# EAGLE design luca (EAGLE 7.3.0)
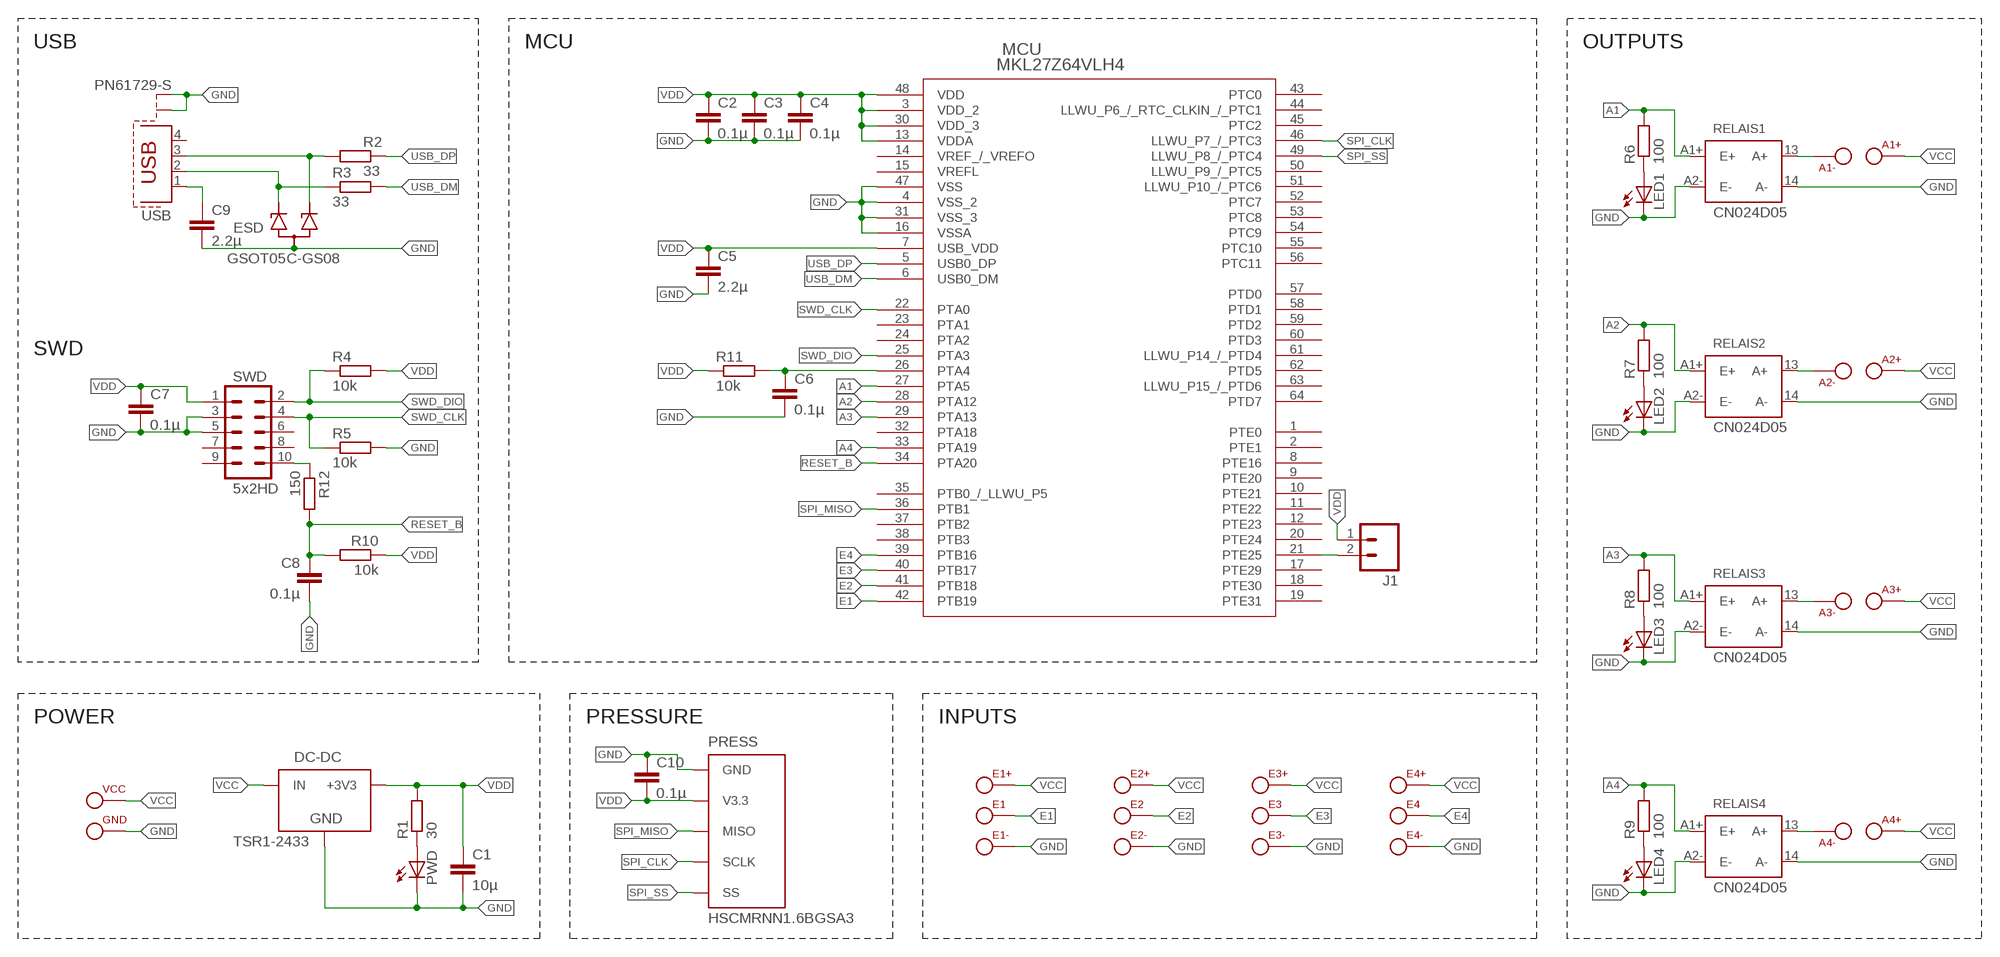
[diagram p0: schematic, sheet 1]

## Parts
A1+  FFKDS-2,54  [FFSDK-2,54]
A1-  FFKDS-2,54  [FFSDK-2,54]
A2+  FFKDS-2,54  [FFSDK-2,54]
A2-  FFKDS-2,54  [FFSDK-2,54]
A3+  FFKDS-2,54  [FFSDK-2,54]
A3-  FFKDS-2,54  [FFSDK-2,54]
A4+  FFKDS-2,54  [FFSDK-2,54]
A4-  FFKDS-2,54  [FFSDK-2,54]
C1  10µ  C-EUC1206  [C1206]
C2  0.1µ  C-EUC1206  [C1206]
C3  0.1µ  C-EUC1206  [C1206]
C4  0.1µ  C-EUC1206  [C1206]
C5  2.2µ  C-EUC1206  [C1206]
C6  0.1µ  C-EUC1206  [C1206]
C7  0.1µ  C-EUC1206  [C1206]
C8  0.1µ  C-EUC1206  [C1206]
C9  2.2µ  C-EUC1206  [C1206]
C10  0.1µ  C-EUC1206  [C1206]
DC-DC  TSR1-2433  [TSR-1]
E1  FFKDS-2,54  [FFSDK-2,54]
E1+  FFKDS-2,54  [FFSDK-2,54]
E1-  FFKDS-2,54  [FFSDK-2,54]
E2  FFKDS-2,54  [FFSDK-2,54]
E2+  FFKDS-2,54  [FFSDK-2,54]
E2-  FFKDS-2,54  [FFSDK-2,54]
E3  FFKDS-2,54  [FFSDK-2,54]
E3+  FFKDS-2,54  [FFSDK-2,54]
E3-  FFKDS-2,54  [FFSDK-2,54]
E4  FFKDS-2,54  [FFSDK-2,54]
E4+  FFKDS-2,54  [FFSDK-2,54]
E4-  FFKDS-2,54  [FFSDK-2,54]
ESD  GSOT05C-GS08  [GSOT05C-GS08]
GND  FFKDS-2,54  [FFSDK-2,54]
J1  M02LOCK  [1X02_LOCK]
LED1  LED  [LED]
LED2  LED  [LED]
LED3  LED  [LED]
LED4  LED  [LED]
MCU  MKL27Z64VLH4  [98ASS23234W]
PRESS  HSCMRNN1.6BGSA3  [HSCMRNN1.6BGSA3]
PWD  LED  [LED]
R1  30  R-EU_M1206  [M1206]
R2  33  R-EU_M1206  [M1206]
R3  33  R-EU_M1206  [M1206]
R4  10k  R-EU_M1206  [M1206]
R5  10k  R-EU_M1206  [M1206]
R6  100  R-EU_M1206  [M1206]
R7  100  R-EU_M1206  [M1206]
R8  100  R-EU_M1206  [M1206]
R9  100  R-EU_M1206  [M1206]
R10  10k  R-EU_M1206  [M1206]
R11  10k  R-EU_M1206  [M1206]
R12  150  R-EU_M1206  [M1206]
RELAIS1  CN024D05  [CN024D05]
RELAIS2  CN024D05  [CN024D05]
RELAIS3  CN024D05  [CN024D05]
RELAIS4  CN024D05  [CN024D05]
SWD  5x2HD  M05X22X  [2X5-PTH-1.27MM]
USB  PN61729-S  [PN61729-S]
VCC  FFKDS-2,54  [FFSDK-2,54]

## Nets
A1: MCU.27(PTA5) R6.2 RELAIS1.A1+(E+)
A2: MCU.28(PTA12) R7.2 RELAIS2.A1+(E+)
A3: MCU.29(PTA13) R8.2 RELAIS3.A1+(E+)
A4: MCU.33(PTA19) R9.2 RELAIS4.A1+(E+)
E1: E1.1 E1.2(P1) MCU.42(PTB19)
E2: E2.1 E2.2(P1) MCU.41(PTB18)
E3: E3.1 E3.2(P1) MCU.40(PTB17)
E4: E4.1 E4.2(P1) MCU.39(PTB16)
GND: C1.2 C2.2 C3.2 C4.2 C5.2 C6.2 C7.2 C8.2 C9.2 C10.1 DC-DC.2(GND) E1-.1 E1-.2(P1) E2-.1 E2-.2(P1) E3-.1 E3-.2(P1) E4-.1 E4-.2(P1) ESD.P$3 GND.1 GND.2(P1) LED1.B(C) LED2.B(C) LED3.B(C) LED4.B(C) MCU.4(VSS_2) MCU.16(VSSA) MCU.31(VSS_3) MCU.47(VSS) PRESS.P$1(GND) PWD.B(C) R5.2 RELAIS1.14(A-) RELAIS1.A2-(E-) RELAIS2.14(A-) RELAIS2.A2-(E-) RELAIS3.14(A-) RELAIS3.A2-(E-) RELAIS4.14(A-) RELAIS4.A2-(E-) SWD.3 SWD.5 USB.S1 USB.S2
N$1: ESD.P$1 R2.1 USB.3
N$2: ESD.P$2 R3.1 USB.2
N$3: C9.1 USB.1
N$4: LED2.A R7.1
N$5: LED1.A R6.1
N$6: A1-.1 A1-.2(P1) RELAIS1.13(A+)
N$7: LED3.A R8.1
N$8: PWD.A R1.1
N$9: A3-.1 A3-.2(P1) RELAIS3.13(A+)
N$10: LED4.A R9.1
N$11: A4-.1 A4-.2(P1) RELAIS4.13(A+)
N$13: J1.2 MCU.21(PTE25)
N$14: A2-.1 A2-.2(P1) RELAIS2.13(A+)
N$15: R12.1 SWD.10
NMI_B: C6.1 MCU.26(PTA4) R11.2
RESET_B: C8.1 MCU.34(PTA20) R10.2 R12.2
SPI_CLK: MCU.46(LLWU_P7_/_PTC3) PRESS.P$4(SCLK)
SPI_MISO: MCU.36(PTB1) PRESS.P$3(MISO)
SPI_SS: MCU.49(LLWU_P8_/_PTC4) PRESS.P$5(SS)
SWD_CLK: MCU.22(PTA0) R5.1 SWD.4
SWD_DIO: MCU.25(PTA3) R4.1 SWD.2
USB_DM: MCU.6(USB0_DM) R3.2
USB_DP: MCU.5(USB0_DP) R2.2
VCC: A1+.1 A1+.2(P1) A2+.1 A2+.2(P1) A3+.1 A3+.2(P1) A4+.1 A4+.2(P1) DC-DC.1(IN) E1+.1 E1+.2(P1) E2+.1 E2+.2(P1) E3+.1 E3+.2(P1) E4+.1 E4+.2(P1) VCC.1 VCC.2(P1)
VDD: C1.1 C2.1 C3.1 C4.1 C5.1 C7.1 C10.2 DC-DC.3(+3V3) J1.1 MCU.3(VDD_2) MCU.7(USB_VDD) MCU.13(VDDA) MCU.30(VDD_3) MCU.48(VDD) PRESS.P$2(V3.3) R1.2 R4.2 R10.1 R11.1 SWD.1
Unconnected: MCU.1(PTE0) MCU.2(PTE1) MCU.8(PTE16) MCU.9(PTE20) MCU.10(PTE21) MCU.11(PTE22) MCU.12(PTE23) MCU.17(PTE29) MCU.18(PTE30) MCU.19(PTE31) MCU.20(PTE24) MCU.23(PTA1) MCU.24(PTA2) MCU.32(PTA18) MCU.35(PTB0_/_LLWU_P5) MCU.37(PTB2) MCU.38(PTB3) MCU.43(PTC0) MCU.44(LLWU_P6_/_RTC_CLKIN_/_PTC1) MCU.45(PTC2) MCU.50(LLWU_P9_/_PTC5) MCU.51(LLWU_P10_/_PTC6) MCU.52(PTC7) MCU.53(PTC8) MCU.54(PTC9) MCU.55(PTC10) MCU.56(PTC11) MCU.57(PTD0) MCU.58(PTD1) MCU.59(PTD2) MCU.60(PTD3) MCU.61(LLWU_P14_/_PTD4) MCU.62(PTD5) MCU.63(LLWU_P15_/_PTD6) MCU.64(PTD7) SWD.6 SWD.7 SWD.8 SWD.9 USB.4

## Notes on the sheet
- USB | MCU | OUTPUTS
- SWD
- POWER | PRESSURE | INPUTS

## Power pins joined to a net without a drawn wire
VREF_/_VREFO: MCU.14(VREF_/_VREFO)
VREFL: MCU.15(VREFL)

## Library data of the parts
A1+ A1- A2+ A2- A3+ A3- A4+ A4- E1 E1+ E1- E2 E2+ E2- E3 E3+ E3- E4 E4+ E4- GND VCC = phoenix_contact:FFKDS-2,54
C1-C10 = rcl:C-EU: CAPACITOR, European symbol
DC-DC = SteelCaveRobotics-Power:TSR1-2433: Traco Power TSR 1-2433 3.3v switching regulator
ESD = GSOT05C-GS08:GSOT05C-GS08
J1 = SparkFun-Connectors:M02: Standard 2-pin 0.1" header. Use with - straight break away headers ( PRT-00116) - right angle break away headers (PRT-00553) - swiss pins (PRT-00743) - machine pins (PRT-00117) - female headers (PRT-00115) Molex polarized connector foot print use with: PRT-08233 with associated crimp pins and housings. 2.54_SCREWTERM for use with PRT-10571. 3.5mm Screw Terminal footprints for PRT-08084 5mm Screw Terminal footprints for use with PRT-08432
LED1-LED4 PWD = LED_luca:LED
MCU = MKL27Z64VLH4:MKL27Z64VLH4; MANUFACTURER_PART_NUMBER: mkl27z64vlh4; VENDOR: Freescale
PRESS = HSCMRNN1.6BGSA3:HSCMRNN1.6BGSA3
R1-R12 = rcl:R-EU_: RESISTOR, European symbol
RELAIS1-RELAIS4 = cn024d05:CN024D05
SWD = SparkFun-Connectors:M05X2: Header 5x2 Standard 10-pin dual row 0.1" header. Commonly used with AVR-ISP. Use with Spark Fun Electronics SKU: PRT-00778
USB = con-berg:PN61729-S: BERG USB connector; OC_FARNELL: unknown; OC_NEWARK: unknown

## Board
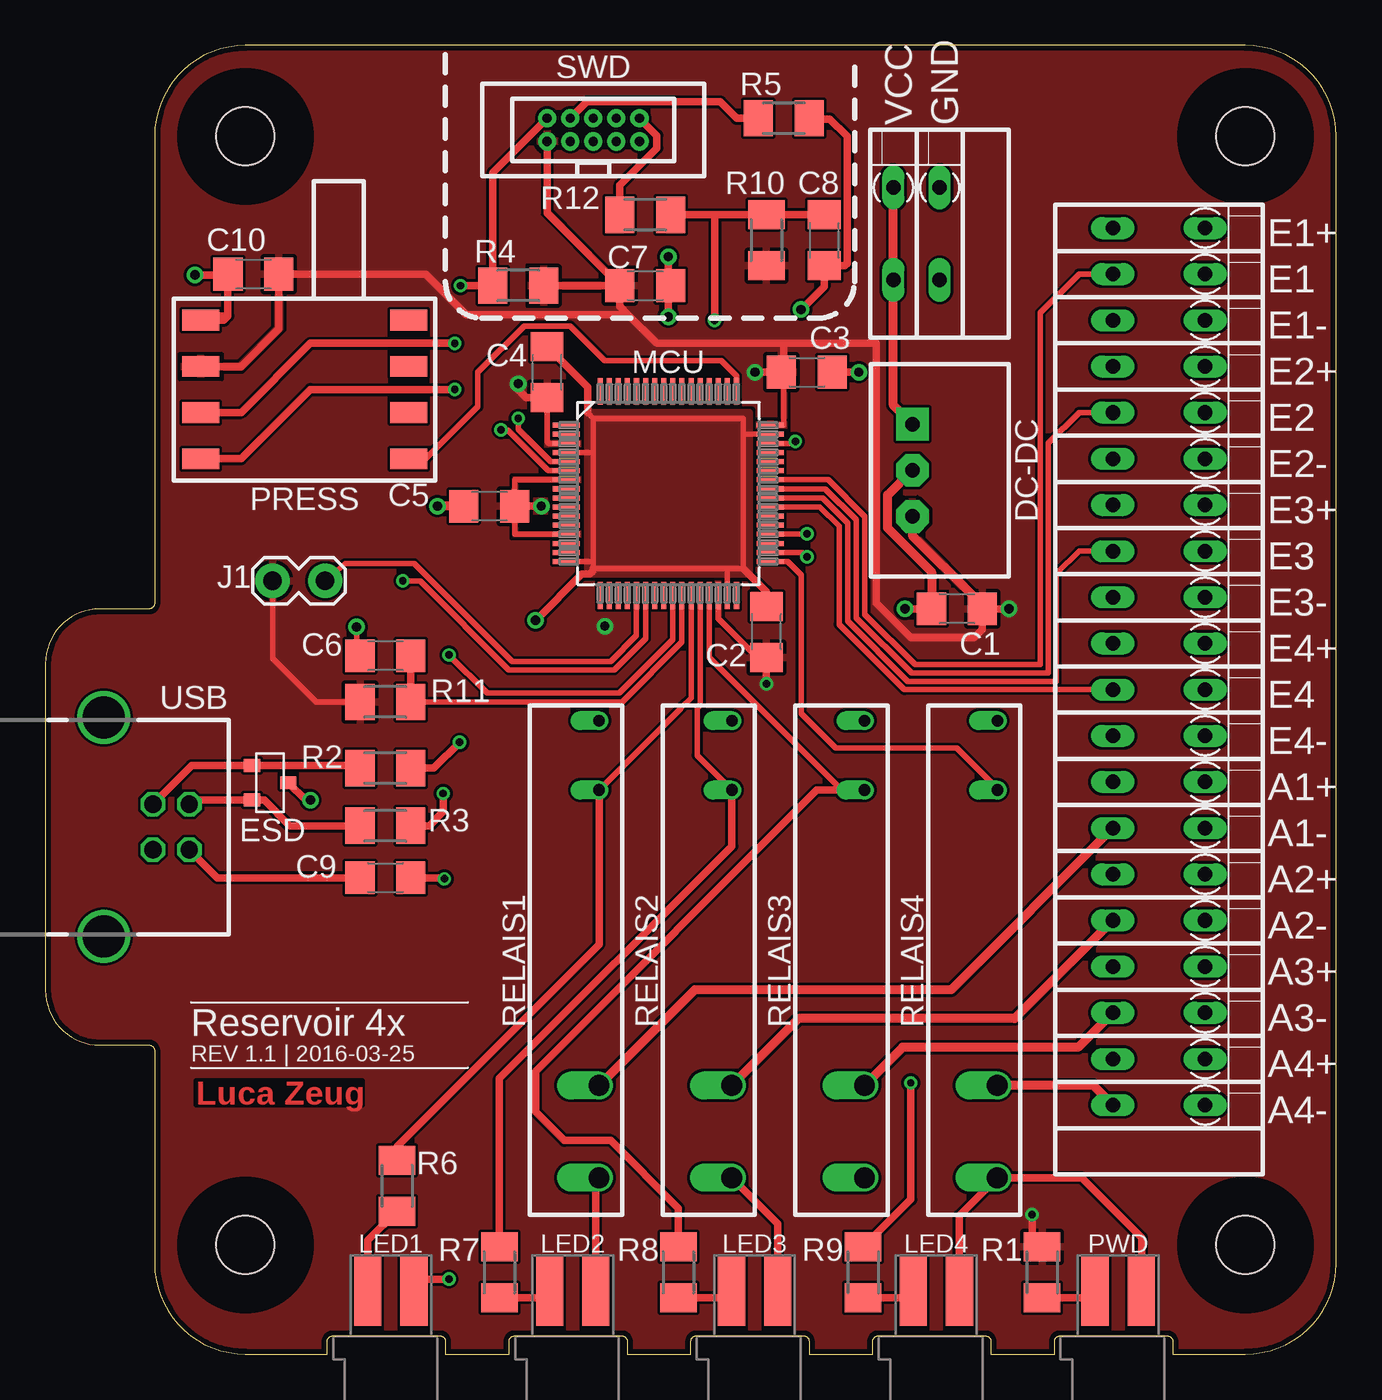
[diagram p1: board, top side]
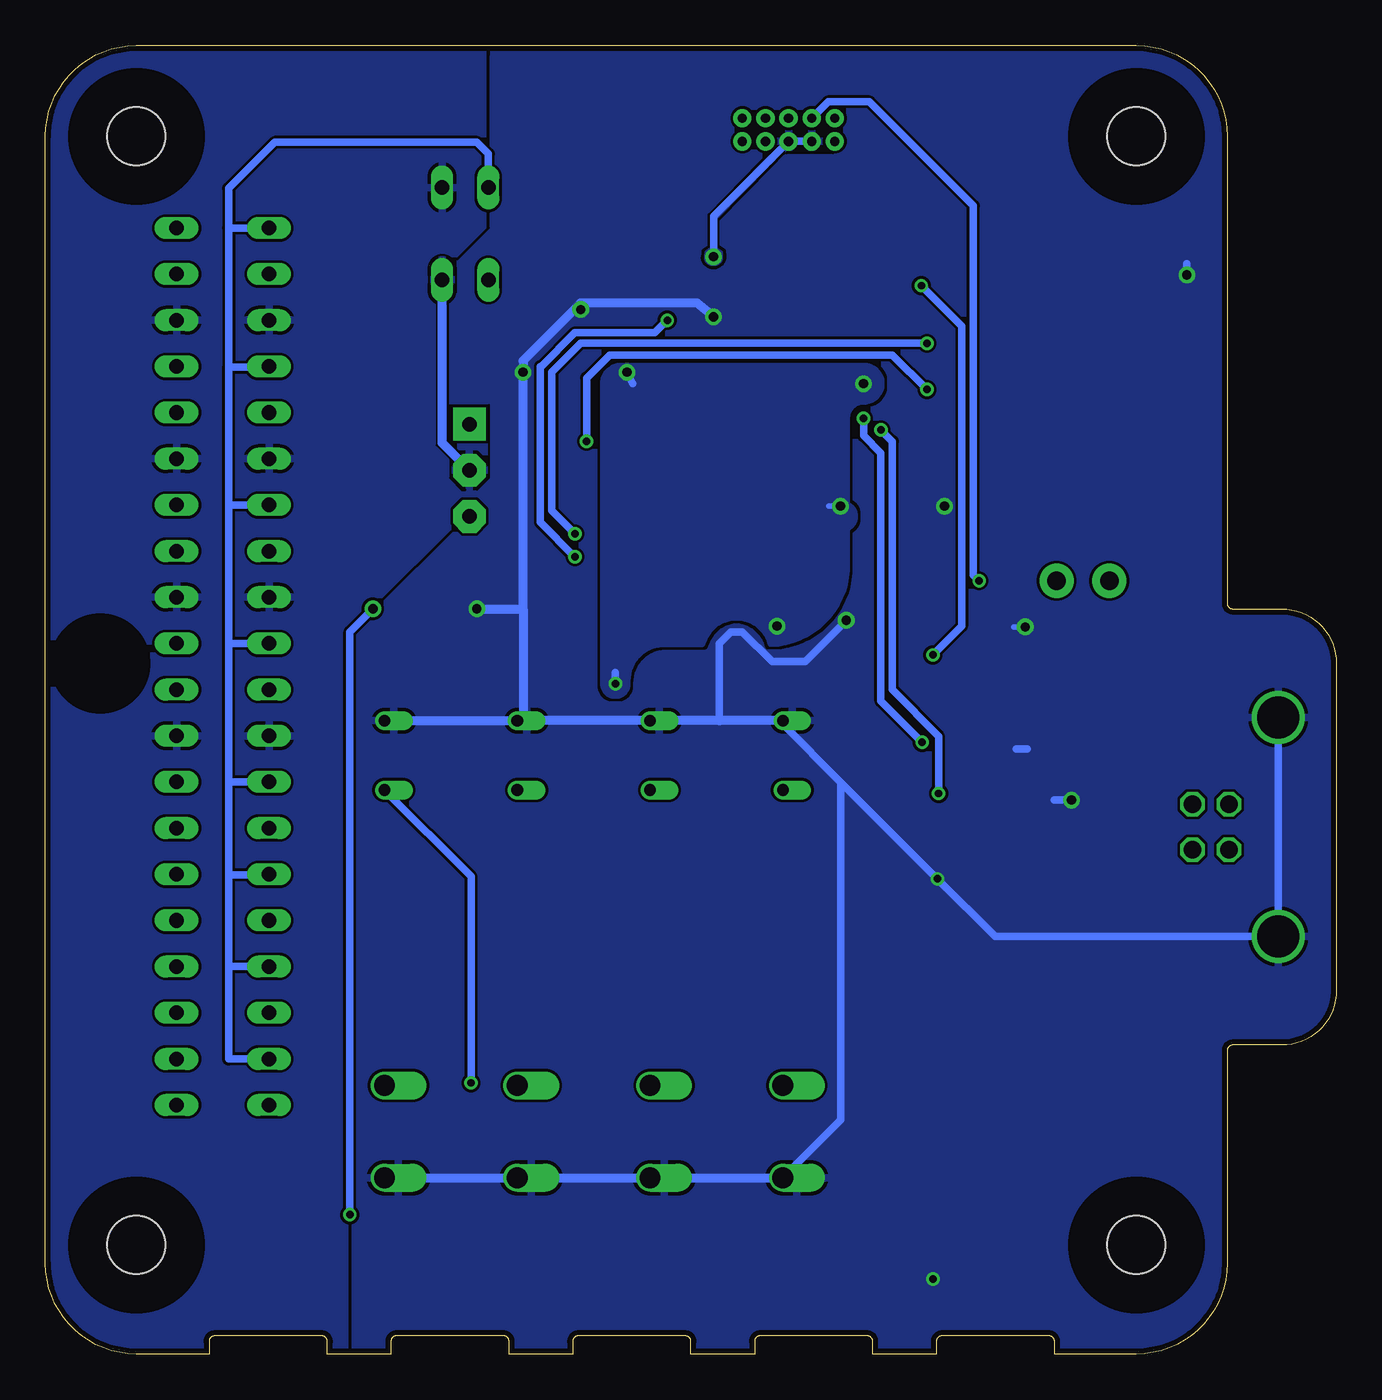
[diagram p2: board, bottom side, seen from below]

Size 71 x 72 mm. Coordinates in mm from the lower left corner, seen from the top.
Outline: 6,5 arc90 11,0 15.5,0 15.5,0.7 arc-90 15.8,1 21.7,1 arc-90 22,0.7 22,0 25.5,0 25.5,0.7 arc-90 25.8,1 31.7,1 arc-90 32,0.7 32,0 35.5,0 35.5,0.7 arc-90 35.8,1 41.7,1 arc-90 42,0.7 42,0 45.5,0 45.5,0.7 arc-90 45.8,1 51.7,1 arc-90 52,0.7 52,0 55.5,0 55.5,0.7 arc-90 55.8,1 61.7,1 arc-90 62,0.7 62,0 66,0 arc90 71,5 71,67 arc90 66,72 11,72 arc90 6,67 6,41.3 arc-90 5.7,41 3,41 arc90 0,38 0,20 arc90 3,17 5.7,17 arc-90 6,16.7 6,5
Copper layers (1*16): Top 0.035mm / dielectric 1.5mm / Bottom 0.035mm
Design rules "PCB-POOL Standard *": minimum track width 0.15mm, minimum drill 0.3mm, track to track 0.15mm, track to pad 0.15mm, pad to pad 0.15mm, via to via 0.15mm, smd to smd 0.15mm, copper to edge 0.3mm, drill to drill 0.2mm, minimum pad ring 0.2mm, minimum via ring 0.15mm, stop-mask expansion 0.075mm, vias tented up to drill 0mil, thermal gap 0.2mm
Holes 3.2 mm at 11,6 11,67 66,67 66,6
tKeepout: area 9,65 to 13,69; area 64,65 to 68,69; area 9,4 to 13,8; area 64,4 to 68,8
bKeepout: area 9,65 to 13,69; area 64,65 to 68,69; area 9,4 to 13,8; area 64,4 to 68,8
tRestrict: area 9,65 to 13,69; area 64,65 to 68,69; area 64,4 to 68,8; area 9,4 to 13,8; area 9,65 to 13,69; 52 lines
bRestrict: area 9,65 to 13,69; area 64,65 to 68,69; area 9,4 to 13,8; area 64,4 to 68,8; area 66,36 to 70,40; 32 lines

### Footprints (pad centres in the part's own frame; a part is rotated, then mirrored left to right if it is on the bottom)
FFSDK-2,54 = drill 0.8 long: 1 0,2.54; 2 0,-2.54
C1206 = smd 1.6 x 1.8: 1 -1.4,0; 2 1.4,0
TSR-1 = drill 0.8 pad 1.8 square: 1 -2.54,-1.5 | drill 0.8 pad 1.8 octagon: 2 0,-1.5; 3 2.54,-1.5
GSOT05C-GS08 = smd 0.7 x 0.9: P$1 0.95,1; P$2 -0.95,1; P$3 0,-1
1X02_LOCK = drill 1.016 pad 1.88: 1 -0.178,0; 2 2.718,0
LED = smd 3.81 x 1.499: A 0.254,1.27; B 0.254,-1.27
98ASS23234W = smd 1.473 x 0.279: 1 -5.613,3.75; 2 -5.613,3.25; 3 -5.613,2.75; 4 -5.613,2.25; 5 -5.613,1.75; 6 -5.613,1.25; 7 -5.613,0.75; 8 -5.613,0.25; 9 -5.613,-0.25; 10 -5.613,-0.75; 11 -5.613,-1.25; 12 -5.613,-1.75; 13 -5.613,-2.25; 14 -5.613,-2.75; 15 -5.613,-3.25; 16 -5.613,-3.75; 33 5.613,-3.75; 34 5.613,-3.25; 35 5.613,-2.75; 36 5.613,-2.25; 37 5.613,-1.75; 38 5.613,-1.25; 39 5.613,-0.75; 40 5.613,-0.25; 41 5.613,0.25; 42 5.613,0.75; 43 5.613,1.25; 44 5.613,1.75; 45 5.613,2.25; 46 5.613,2.75; 47 5.613,3.25; 48 5.613,3.75 | smd 0.279 x 1.473: 17 -3.75,-5.613; 18 -3.25,-5.613; 19 -2.75,-5.613; 20 -2.25,-5.613; 21 -1.75,-5.613; 22 -1.25,-5.613; 23 -0.75,-5.613; 24 -0.25,-5.613; 25 0.25,-5.613; 26 0.75,-5.613; 27 1.25,-5.613; 28 1.75,-5.613; 29 2.25,-5.613; 30 2.75,-5.613; 31 3.25,-5.613; 32 3.75,-5.613; 49 3.75,5.613; 50 3.25,5.613; 51 2.75,5.613; 52 2.25,5.613; 53 1.75,5.613; 54 1.25,5.613; 55 0.75,5.613; 56 0.25,5.613; 57 -0.25,5.613; 58 -0.75,5.613; 59 -1.25,5.613; 60 -1.75,5.613; 61 -2.25,5.613; 62 -2.75,5.613; 63 -3.25,5.613; 64 -3.75,5.613
HSCMRNN1.6BGSA3 = smd 1.143 x 2.032: P$1 -3.81,-5.715; P$2 -1.27,-5.715; P$3 1.27,-5.715; P$4 3.81,-5.715; P$5 3.81,5.715; P$6 1.27,5.715; P$7 -1.27,5.715; P$8 -3.81,5.715
M1206 = smd 1.6 x 2: 1 -1.4,0; 2 1.4,0
CN024D05 = drill 1.143 offset: 13 -6.858,-1.27; 14 -11.938,-1.27 | drill 0.635 offset: A1+ 9.398,-1.27; A2- 13.208,-1.27
2X5-PTH-1.27MM = drill 0.508 pad 1: 1 -2.54,-0.635; 2 -2.54,0.635; 3 -1.27,-0.635; 4 -1.27,0.635; 5 0,-0.635; 6 0,0.635; 7 1.27,-0.635; 8 1.27,0.635; 9 2.54,-0.635; 10 2.54,0.635
PN61729-S = drill 0.95 octagon: 1 1.25,4.71; 2 -1.25,4.71; 3 -1.25,2.71; 4 1.25,2.71 | drill 2.3 pad 2.9: S1 -6.02,0; S2 6.02,0

### Placement (x,y rotation side)
A1+  61.24,31.48 270 top
A1-  61.24,28.94 270 top
A2+  61.24,26.4 270 top
A2-  61.24,23.86 270 top
A3+  61.24,21.32 270 top
A3-  61.24,18.78 270 top
A4+  61.24,16.24 270 top
A4-  61.24,13.7 270 top
C1  50.13,41.01 180 top
C2  39.66,39.73 90 top
C3  41.88,54.02 0 top
C4  27.59,54.02 90 top
C5  24.41,46.65 180 top
C6  18.7,38.42 180 top
C7  32.99,58.78 0 top
C8  42.83,61.28 270 top
C9  18.7,26.21 0 top
C10  11.44,59.42 0 top
DC-DC  49.18,48.62 270 top
E1  61.24,59.42 270 top
E1+  61.24,61.96 270 top
E1-  61.24,56.88 270 top
E2  61.24,51.8 270 top
E2+  61.24,54.34 270 top
E2-  61.24,49.26 270 top
E3  61.24,44.18 270 top
E3+  61.24,46.72 270 top
E3-  61.24,41.64 270 top
E4  61.24,36.56 270 top
E4+  61.24,39.1 270 top
E4-  61.24,34.02 270 top
ESD  12.35,31.43 90 top
GND  49.18,61.64 0 top
J1  12.67,42.55 0 top
LED1  19,3.2 90 top
LED2  29,3.2 90 top
LED3  39,3.2 90 top
LED4  49,3.2 90 top
MCU  34.26,47.35 0 top
PRESS  14.26,53.07 270 top
PWD  59,3.2 90 top
R1  54.81,4.49 90 top
R2  18.7,32.24 0 top
R3  18.7,29.07 0 top
R4  26,58.78 0 top
R5  40.61,67.99 0 top
R6  19.34,9.26 90 top
R7  24.97,4.49 90 top
R8  34.81,4.49 90 top
R9  44.97,4.49 90 top
R10  39.66,61.28 90 top
R11  18.7,35.88 0 top
R12  32.99,62.68 0 top
RELAIS1  29.18,21.64 90 top
RELAIS2  36.48,21.64 90 top
RELAIS3  43.78,21.64 90 top
RELAIS4  51.09,21.64 90 top
SWD  30.13,67.36 0 top
USB  3.2,29 270 top
VCC  46.64,61.64 0 top

### Tracks (layer width: path | path; a pad name or v marks a point on that pad's centre or on a via)
A1
  Top 0.305: RELAIS1.A1+ 34.93,35.52 35.01,35.6 35.51,36.1 MCU.27
  Top 0.406: R6.2 19.34,11.43 30.45,22.54 RELAIS1.A1+
A2
  Top 0.305: MCU.28 36.01,35.72 35.84,35.56 35.84,32.94 RELAIS2.A1+
  Top 0.406: R7.2 24.97,15.16 37.75,27.94 RELAIS2.A1+
A3
  Top 0.305: 42.96,31.04 43.78,31.04 36.51,38.31 MCU.29
  Top 0.406: R8.2 34.81,8.02 31.08,11.75 28.54,11.75 26.95,13.34 26.95,15.56 42.43,31.04 43.78,31.04 RELAIS3.A1+
A4  (via drill 0.41)
  Top 0.305: RELAIS4.A1+ 52.35,31.11 50.13,33.34 43.47,33.34 41.56,35.24 41.56,42.86 40.82,43.6 MCU.33
  Top 0.406: R9.2 47.59,8.51 v47.59,14.92
  Bottom 0.406: v47.59,14.92 47.59,26.27 RELAIS4.A1+
E1
  Top 0.29: 47.83,37.94 54.7,37.94 54.72,57.29 56.85,59.42
  Top 0.305: MCU.42 43.05,48.1 45.07,46.08 45.07,40.69 47.83,37.94 | E1.2 56.85,59.42
E2
  Top 0.29: 47.63,37.47 55.16,37.47 55.16,50.11 56.85,51.8
  Top 0.305: MCU.41 42.9,47.6 44.6,45.91 44.6,40.51 47.63,37.47 | E2.2 56.85,51.8
E3
  Top 0.29: 47.44,37.02 55.6,37.02 55.6,42.93 56.85,44.18
  Top 0.305: MCU.40 42.74,47.1 44.12,45.73 44.12,40.33 47.44,37.02 | E3.2 56.85,44.18
E4
  Top 0.29: 47.24,36.56 E4.2
  Top 0.305: MCU.39 42.59,46.6 43.65,45.55 43.65,40.15 47.24,36.56
GND  (via drill 0.41, 0.51)
  Top 0.29: 30.13,49.6 MCU.4 | MCU.16 30.13,43.6 | MCU.47 38.38,50.6 | C6.2 17.11,38.6 v17.11,40.01 | 9.9,59.4 9.81,59.49 9.81,60.01
  Top 0.305: 30.13,51.48 38.38,51.48 38.38,50.6 38.38,43.23 37.51,43.23 | 30.13,51.48 30.13,49.6 | 37.51,43.23 30.13,43.23 30.13,43.6 30.13,49.58 | MCU.31 37.51,43.23 | 29.81,51.8 30.13,51.48
  Top 0.406: PWD.B 60.29,3.48 60.29,6.4 56.99,9.7 RELAIS4.14 50.27,7.61 LED4.B | 9.81,60.01 C10.1 10.04,57.11 | C2.2 39.66,41.96 38.38,43.23 | C3.2 v44.73,54.02 | v47.27,41.01 C1.2 | 30.13,43.23 arc-90 29.81,42.91 29.5,42.91 v26.95,40.37 | v34.26,60.37 34.26,58.91 C7.2 34.26,58.78 v34.26,57.07 | PRESS.P$1 9.81,56.88 10.04,57.11 | C4.2 29.81,53.2 29.81,51.8 | v21.94,26.15 21.88,26.21 C9.2 | LED3.B 40.27,7.18 RELAIS2.14 | LED2.B 30.27,9.52 RELAIS1.14 | R5.2 42.05,67.94 43.15,67.94 44.1,66.99 44.1,60.01 43.97,59.88 C8.2 42.83,58.74 v41.56,57.47 | LED1.B 20.94,4.13 v22.19,4.13 | 10.04,57.11 8.5,57.11 | 9.9,59.4 9.9,59.37 v8.22,59.37 | ESD.P$3 14.3,30.48 v14.57,30.48
  Top 0.508: DC-DC.2 46.32,47.27 46.32,45.45 48.73,43.04 C1.2 | C5.2 v21.56,46.65
  Bottom 0.29: v17.11,40.01 17.75,40.01
  Bottom 0.406: SWD.3 SWD.5 34.26,62.59 v34.26,60.37 | USB.S1 USB.S2 18.77,22.98 v21.94,26.15 27.25,31.46 | 33.94,34.85 33.94,39.1 33.3,39.73 32.67,39.73 31.04,38.1 29.23,38.1 v26.95,40.37 | 27.25,31.46 30.45,34.66 RELAIS1.A2- | RELAIS1.14 27.27,12.87 27.27,16.51 27.25,16.53 27.25,31.46 | 17,33.3 17.6,33.3 | v8.22,59.37 8.22,60.01 | v14.57,30.48 15.53,30.48
  Bottom 0.508: GND.2 49.18,50.12 DC-DC.2 | 44.73,41.01 v44.73,54.02 44.73,54.66 41.56,57.83 35.15,57.83 v34.26,57.07 | v47.27,41.01 44.73,41.01 | 44.73,41.01 44.73,34.85 RELAIS3.A2- | RELAIS4.A2- RELAIS3.A2- | RELAIS3.A2- RELAIS2.A2- 33.94,34.85 RELAIS1.A2- | RELAIS4.14 RELAIS3.14 RELAIS2.14 RELAIS1.14
  pour Top: 29.81,51.8 38.7,51.8 38.7,42.91 29.81,42.91
  pour Bottom (rank 2): 6,67 arc-90 11,72 66,72 arc-90 71,67 71,5 arc-90 66,0 11,0 arc-90 6,5 6,16.7 arc90 5.7,17 3,17 arc-90 0,20 0,38 arc-90 3,41 5.7,41 arc90 6,41.3
N$1
  Top 0.29: 17.16,32.38 R2.1
  Top 0.406: USB.3 8.04,32.38 ESD.P$1 17.16,32.38
N$2
  Top 0.406: USB.2 8.14,30.48 ESD.P$2 12.03,30.48 13.45,29.07 R3.1
N$3
  Top 0.406: C9.1 9.45,26.21 USB.1
N$4
  Top 0.406: LED2.A 27.37,3.09 R7.1
N$5
  Top 0.406: LED1.A 17.73,6.25 R6.1
N$6
  Top 0.508: A1-.2 49.81,20.05 35.72,20.05 RELAIS1.13
N$7
  Top 0.406: LED3.A 37.37,3.09 R8.1
N$8
  Top 0.406: PWD.A 57.37,3.09 R1.1
N$9
  Top 0.508: A3-.2 56.8,16.88 47.15,16.88 RELAIS3.13
N$10
  Top 0.406: LED4.A 47.37,3.09 R9.1
N$11
  Top 0.508: A4-.2 57.63,14.78 RELAIS4.13
N$13
  Top 0.29: MCU.21 32.51,39.52 31.08,38.1 25.68,38.1 20.29,43.5 16.48,43.5 J1.2
N$14
  Top 0.508: A2-.2 53.31,18.46 41.43,18.46 RELAIS2.13
N$15
  Top 0.406: R12.1 31.59,64.32 33.62,66.36 33.62,67.04 SWD.10
NMI_B
  Top 0.305: MCU.26 35.01,39.17 31.72,35.88 R11.2
  Top 0.4: C6.1 R11.2
RESET_B  (via drill 0.41)
  Top 0.305: v41.88,43.86 41.63,44.1 MCU.34
  Top 0.406: C8.1 R10.2 36.8,62.68 | R12.2 36.8,62.68 | 36.8,62.68 v36.8,56.88
  Bottom 0.406: v41.88,43.86 43.78,45.77 43.78,54.34 43.73,54.34 41.88,56.2 37.48,56.2 v36.8,56.88
SPI_CLK  (via drill 0.41)
  Top 0.29: MCU.46 41.13,50.1
  Top 0.305: 41.13,50.1 v41.24,50.21
  Top 0.406: PRESS.P$4 10.76,49.26 14.57,53.07 v22.51,53.07
  Bottom 0.406: v22.51,53.07 24.41,54.98 39.97,54.98 41.24,53.7 v41.24,50.21
SPI_MISO  (via drill 0.41)
  Top 0.305: v41.88,45.13 41.85,45.1 MCU.36
  Top 0.406: PRESS.P$3 10.76,51.8 14.57,55.61 v22.51,55.61
  Bottom 0.406: v41.88,45.13 43.15,46.4 43.15,54.02 41.56,55.61 v22.51,55.61
SPI_SS
  Top 0.29: MCU.49 38.01,53.81 37.16,54.66 30.77,54.66
  Top 0.305: 30.77,54.66 28.86,56.56 26.32,56.56 23.78,54.02 23.78,52.12 20.92,49.26 PRESS.P$5
SWD_CLK  (via drill 0.4)
  Top 0.29: MCU.22 33.01,39.38 31.27,37.65 25.49,37.65 20.62,42.55 v19.65,42.55
  Top 0.406: SWD.4 29.77,68.9 37.11,68.9 38.02,67.99 R5.1
  Bottom 0.406: 28.81,67.99 SWD.4 27.95,68.9 25.68,68.9 19.97,63.18 19.97,42.86 v19.65,42.55
SWD_DIO  (via drill 0.41)
  Top 0.29: v22.19,38.47 24.3,36.36 31.57,36.36 34.51,39.3 MCU.25
  Top 0.406: v22.83,58.78 R4.1 24.6,65 SWD.2
  Bottom 0.406: v22.83,58.78 20.61,56.56 20.61,40.05 v22.19,38.47
USB_DM  (via drill 0.41)
  Top 0.29: v25.05,50.85 25.42,50.85 27.66,48.6 MCU.6
  Top 0.406: R3.2 21.1,29.07 21.88,29.84 v21.88,30.84
  Bottom 0.406: v25.05,50.85 24.41,50.21 24.41,36.56 21.88,33.97 v21.88,30.84
USB_DP  (via drill 0.41)
  Top 0.29: v26,51.48 26,50.9 27.8,49.1 MCU.5
  Top 0.406: R2.2 21.37,32.24 v22.78,33.66
  Bottom 0.406: v26,51.48 26,50.53 25.05,49.58 25.05,35.92 v22.78,33.66
VCC
  Top 0.508: VCC.1 VCC.2 46.64,52.2 DC-DC.1
  Bottom 0.406: VCC.1 46.64,66.04 47.27,66.67 58.39,66.67 60.93,64.14 60.93,61.96 | E1+.2 60.93,61.96 | 60.93,61.96 60.93,54.29 | 60.93,54.29 58.7,54.29 E2+.2 | E3+.2 60.93,46.72 | 60.93,46.72 60.93,54.29 | E4+.2 60.93,39.1 | 60.93,39.1 60.93,46.72 | A1+.2 60.93,31.48 | 60.93,31.48 60.93,39.1 | A4+.2 60.93,16.24 60.93,21.32 | 60.93,21.32 60.93,26.35 | 60.93,26.35 60.93,31.48 | 60.93,21.32 A3+.2 | A2+.2 58.7,26.35 60.93,26.35
VDD  (via drill 0.41, 0.51, 0.51 pad 0.33)
  Top 0.29: MCU.3 27.7,50.1 27.59,50.21 C4.1 | 40.61,53.38 40.61,51.1 MCU.48 | MCU.7 25.82,48.1 C5.1 25.82,45.1 MCU.13 | J1.1 12.49,38.28 14.89,35.88 R11.1
  Top 0.305: MCU.30 37.01,40.48 39.15,38.34 C2.1 | MCU.13 28.25,45.1
  Top 0.406: 9.18,54.34 PRESS.P$2 10.76,54.34 12.84,56.41 C10.2 20.92,59.42 23.14,57.2 32.03,57.2 32.04,57.2 | 27.27,58.66 R4.2 C7.1 | R1.2 54.26,5.89 v54.26,7.67 | C1.1 v52.99,41.01 | C2.1 v39.66,36.88 | C3.1 40.61,54.02 40.61,55.61 | C3.1 v39.02,54.02 | 40.61,53.38 C3.1 | 51.08,41.64 C1.1 | 40.61,55.61 33.62,55.61 32.04,57.2 | 40.61,55.61 45.69,55.61 45.69,41.32 47.59,39.42 51.09,39.42 51.53,39.87 C1.1 | 27.59,52.75 C4.1 26.45,52.62 26,53.07 v26,53.39 | C7.1 31.59,57.65 32.04,57.2 | v27.27,46.65 C5.1 | SWD.1 27.59,62.78 C7.1
  Top 0.508: DC-DC.3 47.68,45.05 51.08,41.64
  Bottom 0.305: v27.27,46.65 27.91,46.65
  Bottom 0.406: v54.26,7.67 54.26,39.73 v52.99,41.01 | v39.66,36.88 39.66,37.51 | v39.02,54.02 38.7,53.39
  other vias: 30.77,40.05
  pour Bottom: 39.34,54.34 arc-90 40.29,53.39 40.29,36.88 arc-180 39.02,36.88 arc90 37.11,39.1 34.89,39.1 arc150 31.08,39.1 arc-90 26.95,43.55 26.95,45.45 arc-140 26.95,46.72 26.95,51.48 arc90 26,52.44 arc-180 26,54.34
  pour Top (rank 2): 6,67 arc-90 11,72.64 66,72.64 arc-90 71.64,67.42 71.64,5.32 arc-90 66,0 11,0 arc-90 6,5 6,16.7 arc90 5.7,17 3,17 arc-90 0,20 0,38 arc-90 3,41 5.7,41 arc90 6,41.3

### Text on the board
Top: Luca Zeug
tNames: USB | Reservoir 4x | REV 1.1 | 2016-03-25
tValues: FFKDS/V-2.54 | FFKDS/V-2.54
tStop: Luca Zeug